# EAGLE design LTC3125 (EAGLE 7.1.0)
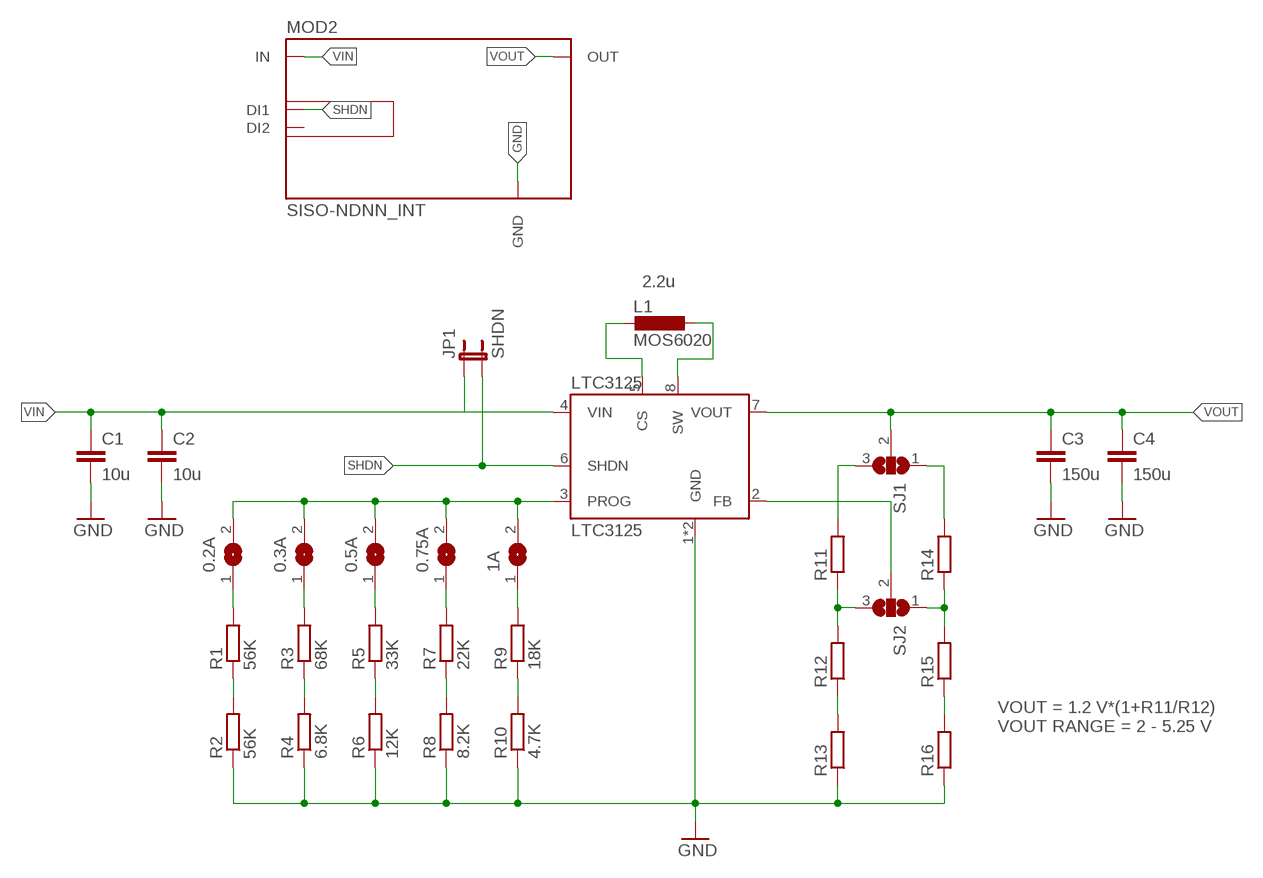
[diagram p0: schematic, sheet 1]

## Parts
0.2A  SJ2  [SJ2]
0.3A  SJ2  [SJ2]
0.5A  SJ2  [SJ2]
0.75A  SJ2  [SJ2]
1A  SJ2  [SJ2]
C1  10u  C-EUC0805  [C0805]
C2  10u  C-EUC0805  [C0805]
C3  150u  C-EUC0805  [C0805]
C4  150u  C-EUC0805  [C0805]
JP1  SHDN  JP2_SMALL_PAD  [JP2_SMALL_PAD]
L1  MOS6020  [MOS6020]
LTC3125  LTC3125  [DFN8-2X3]
MOD2  SISO-NDNN_INT  [SISO-NDNN]
R1  56K  R-EU_R0805  [R0805]
R2  56K  R-EU_R0805  [R0805]
R3  68K  R-EU_R0805  [R0805]
R4  6.8K  R-EU_R0805  [R0805]
R5  33K  R-EU_R0805  [R0805]
R6  12K  R-EU_R0805  [R0805]
R7  22K  R-EU_R0805  [R0805]
R8  8.2K  R-EU_R0805  [R0805]
R9  18K  R-EU_R0805  [R0805]
R10  4.7K  R-EU_R0805  [R0805]
R11  R-EU_R0805  [R0805]
R12  R-EU_R0805  [R0805]
R13  R-EU_R0805  [R0805]
R14  R-EU_R0805  [R0805]
R15  R-EU_R0805  [R0805]
R16  R-EU_R0805  [R0805]
SJ1  SJ3  [SJ3]
SJ2  SJ3  [SJ3]

## Nets
GND: C1.2 C2.2 C3.2 C4.2 LTC3125.1(GND) LTC3125.EXP(GND) R2.1 R4.1 R6.1 R8.1 R10.1 R13.1 R16.1
N$1: 0.2A.2 0.3A.2 0.5A.2 0.75A.2 1A.2 LTC3125.3(PROG)
N$2: 0.2A.1 R1.2
N$3: 0.3A.1 R3.2
N$4: 0.5A.1 R5.2
N$5: 0.75A.1 R7.2
N$6: 1A.1 R9.2
N$7: R1.1 R2.2
N$8: R3.1 R4.2
N$9: R5.1 R6.2
N$10: L1.1 LTC3125.5(CS)
N$11: L1.2 LTC3125.8(SW)
N$12: R11.1 R12.2 SJ2.3
N$13: R7.1 R8.2
N$14: R9.1 R10.2
N$15: R12.1 R13.2
N$16: R11.2 SJ1.3
N$17: LTC3125.2(FB) SJ2.2
N$18: R14.2 SJ1.1
N$19: R14.1 R15.2 SJ2.1
N$20: R15.1 R16.2
SHDN: JP1.2 LTC3125.6(SHDN) MOD2.DI1
VIN: C1.1 C2.1 JP1.1 LTC3125.4(VIN) MOD2.IN1(IN) MOD2.IN2(IN) MOD2.IN3(IN) MOD2.IN4(IN)
VOUT: C3.1 C4.1 LTC3125.7(VOUT) MOD2.OUT1(OUT) MOD2.OUT2(OUT) MOD2.OUT3(OUT) MOD2.OUT4(OUT) SJ1.2
Unconnected: MOD2.DI2

## Notes on the sheet
- 2.2u
- VOUT = 1.2 V*(1+R11/R12)
  VOUT RANGE = 2 - 5.25 V

## Power pins joined to a net without a drawn wire
GND: MOD2.GND1(GND) MOD2.GND2(GND) MOD2.GND3(GND) MOD2.GND4(GND)

## Library data of the parts
0.2A 0.3A 0.5A 0.75A 1A = Jumper_mod:SJ2: SMD solder JUMPER
C1-C4 = rcl:C-EU: CAPACITOR, European symbol
JP1 = Jumper_mod:JP2_SMALL_PAD
L1 = MOS6020:MOS6020: COILCRAFT
LTC3125 = LTC3125:LTC3125
MOD2 = AllModules:SISO-NDNN_INT
R1-R16 = rcl:R-EU_: RESISTOR, European symbol
SJ1 SJ2 = Jumper_mod:SJ3: SMD solder JUMPER

## Board
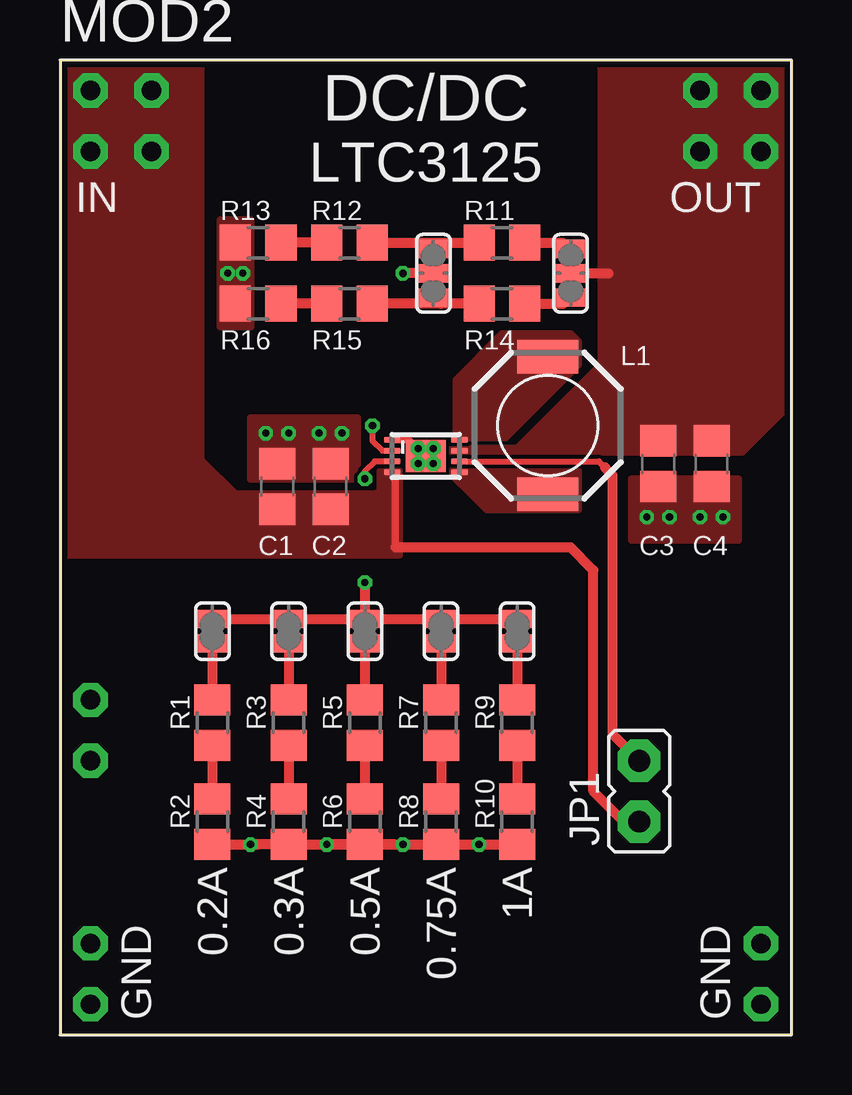
[diagram p1: board, top side]
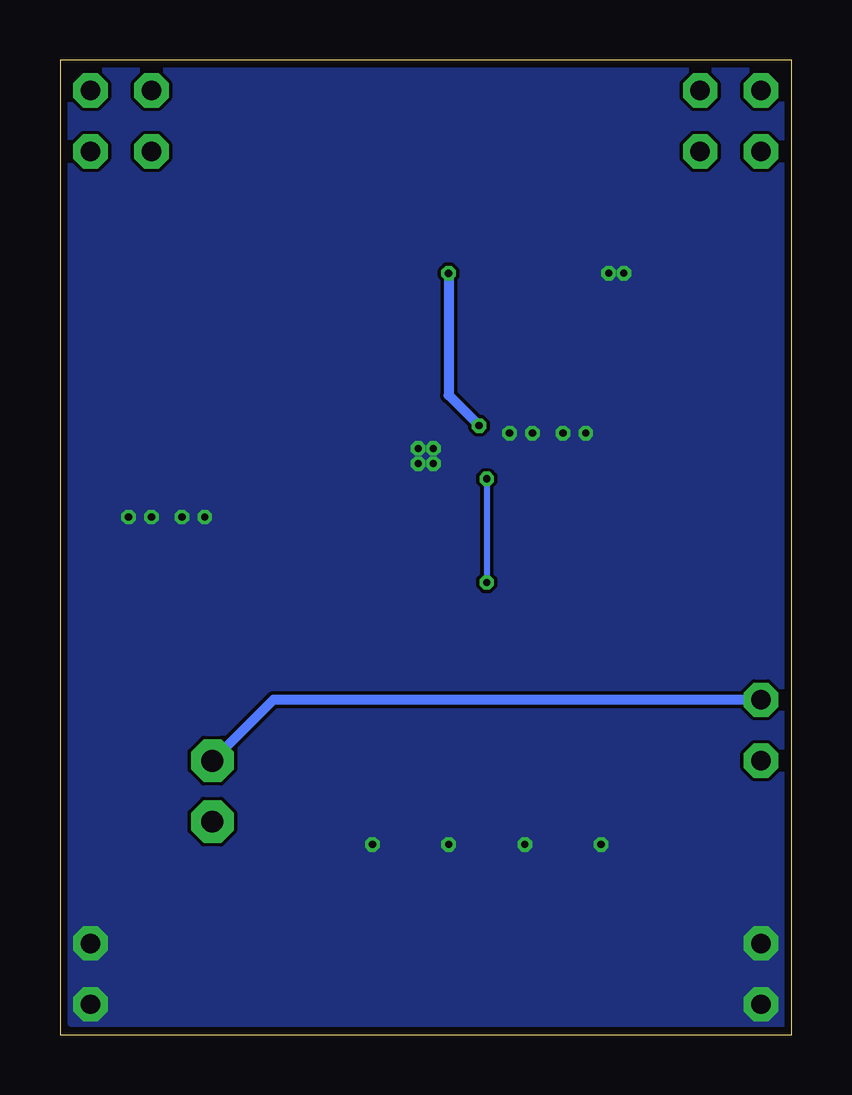
[diagram p2: board, bottom side, seen from below]

Size 30.48 x 40.64 mm. Coordinates in mm from the lower left corner, seen from the top.
Outline: 0,40.64 30.48,40.64 30.48,0 0,0 0,40.64
Copper layers (1*16): Top 0.035mm / dielectric 1.5mm / Bottom 0.035mm
Design rules "PCB-POOL Standard": minimum track width 0.15mm, minimum drill 0.3mm, track to track 0.15mm, track to pad 0.15mm, pad to pad 0.15mm, via to via 0.15mm, smd to smd 0.15mm, copper to edge 0.3mm, drill to drill 0.2mm, minimum pad ring 0.2mm, minimum via ring 0.15mm, stop-mask expansion 0.075mm, vias tented up to drill 0mil, thermal gap 0.2mm

### Footprints (pad centres in the part's own frame; a part is rotated, then mirrored left to right if it is on the bottom)
SJ2 = smd 0.762 x 1.27: 1 -0.508,0; 2 0.508,0
C0805 = smd 1.3 x 1.5: 1 -0.95,0; 2 0.95,0
JP2_SMALL_PAD = drill 0.914 pad 1.778 octagon: 1 -2.54,0; 2 0,0
MOS6020 = smd 1.397 x 2.54: 1 -2.857,0; 2 2.857,0
DFN8-2X3 = smd 0.25 x 0.7: 1 -0.675,-1.4; 2 -0.225,-1.4; 3 0.225,-1.4; 4 0.675,-1.4; 5 0.675,1.4; 6 0.225,1.4; 7 -0.225,1.4; 8 -0.675,1.4 | smd 1.35 x 1.65: EXP 0,0
SISO-NDNN = drill 0.8 pad 1.422 octagon: DI1 0,-25.4; DI2 0,-27.94; GND1 0,-38.1; GND2 0,-35.56; GND3 27.94,-35.56; GND4 27.94,-38.1; IN1 0,0; IN2 0,-2.54; IN3 2.54,0; IN4 2.54,-2.54; OUT1 25.4,0; OUT2 25.4,-2.54; OUT3 27.94,0; OUT4 27.94,-2.54
R0805 = smd 1.3 x 1.5: 1 -0.95,0; 2 0.95,0
SJ3 = smd 0.762 x 1.27: 1 -1.016,0; 2 0,0; 3 1.016,0

### Placement (x,y rotation side)
0.2A  6.35,16.83 90 top
0.3A  9.53,16.83 90 top
0.5A  12.7,16.83 90 top
0.75A  15.88,16.83 90 top
1A  19.05,16.83 90 top
C1  9.05,22.86 90 top
C2  11.27,22.86 90 top
C3  24.92,23.81 270 top
C4  27.15,23.81 270 top
JP1  24.13,11.43 90 top
L1  20.32,25.4 90 top
LTC3125  15.24,24.13 270 top
MOD2  1.27,39.37 0 top
R1  6.35,13.02 90 top
R2  6.35,8.89 90 top
R3  9.53,13.02 90 top
R4  9.53,8.89 90 top
R5  12.7,13.02 90 top
R6  12.7,8.89 90 top
R7  15.88,13.02 90 top
R8  15.88,8.89 90 top
R9  19.05,13.02 90 top
R10  19.05,8.89 90 top
R11  18.41,33.02 0 top
R12  12.06,33.02 0 top
R13  8.26,33.02 0 top
R14  18.41,30.48 0 top
R15  12.06,30.48 0 top
R16  8.26,30.48 0 top
SJ1  21.27,31.75 90 top
SJ2  15.56,31.75 90 top

### Tracks (layer width: path | path; a pad name or v marks a point on that pad's centre or on a via)
GND  (via drill 0.3)
  Top 0.254: LTC3125.1 14.56,24.8 v14.92,24.45 LTC3125.EXP
  Top 0.406: R8.1 | R2.1 8.25,7.94 v7.94,7.94 8.26,7.94 R4.1 | R4.1 10.16,7.94 | R4.1 12.38,7.94 v11.11,7.94 13.97,7.94 | 13.97,7.94 R6.1 | 13.97,7.94 v14.29,7.94 R8.1 | R8.1 v17.46,7.94 18.73,7.94 R10.1
  other vias: 15.56,24.45 15.56,23.81 14.92,23.81 26.67,21.59 27.62,21.59 25.4,21.59 24.45,21.59 10.79,25.08 11.75,25.08 9.53,25.08 8.57,25.08 6.99,31.75 7.62,31.75
  pour Top (no thermals): 7.94,23.18 7.94,25.72 12.38,25.72 12.38,23.18
  pour Bottom (rank 2, no thermals): 0.32,40.32 0.32,0.48 30,0.48 30,40.32
  pour Top (no thermals): 23.81,20.64 23.81,23.18 28.26,23.18 28.26,20.64
  pour Top (no thermals): 6.67,29.53 6.67,33.97 7.94,33.97 7.94,29.53
N$1  (via drill 0.3)
  Top 0.254: LTC3125.3 13.11,23.91 12.7,23.5 v12.7,23.18
  Top 0.406: 0.2A.2 0.3A.2 0.5A.2 | v12.7,18.86 0.5A.2 | 0.5A.2 0.75A.2 1A.2
  Bottom 0.254: v12.7,23.18 v12.7,18.86
N$2
  Top 0.406: 0.2A.1 R1.2
N$3
  Top 0.406: 0.3A.1 R3.2
N$4
  Top 0.406: 0.5A.1 R5.2
N$5
  Top 0.406: 0.75A.1 R7.2
N$6
  Top 0.406: 1A.1 R9.2
N$7
  Top 0.406: R1.1 R2.2
N$8
  Top 0.406: R3.1 R4.2
N$9
  Top 0.406: R5.1 R6.2
N$10
  pour Top (no thermals): 16.35,23.5 16.35,23.34 17.78,21.91 21.59,21.91 21.59,23.5
N$11
  pour Top (rank 2, no thermals): 16.51,24.77 16.51,27.3 18.41,29.21 21.27,29.21 21.59,28.89 21.59,27.94 18.41,24.77
N$12
  Top 0.406: R12.2 15.88,33.02 | 15.88,33.02 R11.1 | SJ2.3 15.88,33.02
N$13
  Top 0.406: R7.1 R8.2
N$14
  Top 0.406: R9.1 R10.2
N$15
  Top 0.406: R12.1 R13.2
N$16
  Top 0.406: R11.2 20.95,33.02 SJ1.3
N$17  (via drill 0.3)
  Top 0.254: v13.02,25.4 13.02,24.77 13.43,24.36 LTC3125.2
  Top 0.406: SJ2.2 v14.29,31.75
  Bottom 0.406: v14.29,31.75 14.29,26.67 v13.02,25.4
N$18
  Top 0.406: R14.2 20.95,30.48 SJ1.1
N$19
  Top 0.406: R14.1 15.88,30.48 | 15.88,30.48 R15.2 | SJ2.1 15.88,30.48
N$20
  Top 0.406: R15.1 R16.2
SHDN
  Top 0.254: LTC3125.6 22.45,23.91 22.7,23.65
  Top 0.406: 22.7,23.65 23.02,23.34 23.02,12.54 JP1.2
  Bottom 0.406: MOD2.DI1 21.59,13.97 JP1.2
VIN
  Top 0.305: 13.97,20.32 13.97,23.27 LTC3125.4
  Top 0.406: JP1.1 23.5,8.89 22.23,10.16 22.23,19.37 21.27,20.32 13.97,20.32
  pour Top (no thermals): 0.32,40.32 0.32,20 14.13,20 14.13,23.5 13.34,23.5 13.34,22.7 13.18,22.54 7.3,22.54 5.87,23.97 5.87,40.32
VOUT
  Top 0.406: SJ1.2 22.86,31.75
  pour Top (no thermals): 16.35,24.45 16.35,24.29 28.42,24.29 30.48,26.35 30.48,40.64 22.54,40.64 22.54,27.94 19.05,24.45

### Text on the board
tNames: DC/DC | LTC3125
bStop: Beckedahl & Kokert / 18.09.2015